# EAGLE design measurementdevice (EAGLE 9.3.0)

## Sheet 1 of 3: Connectors
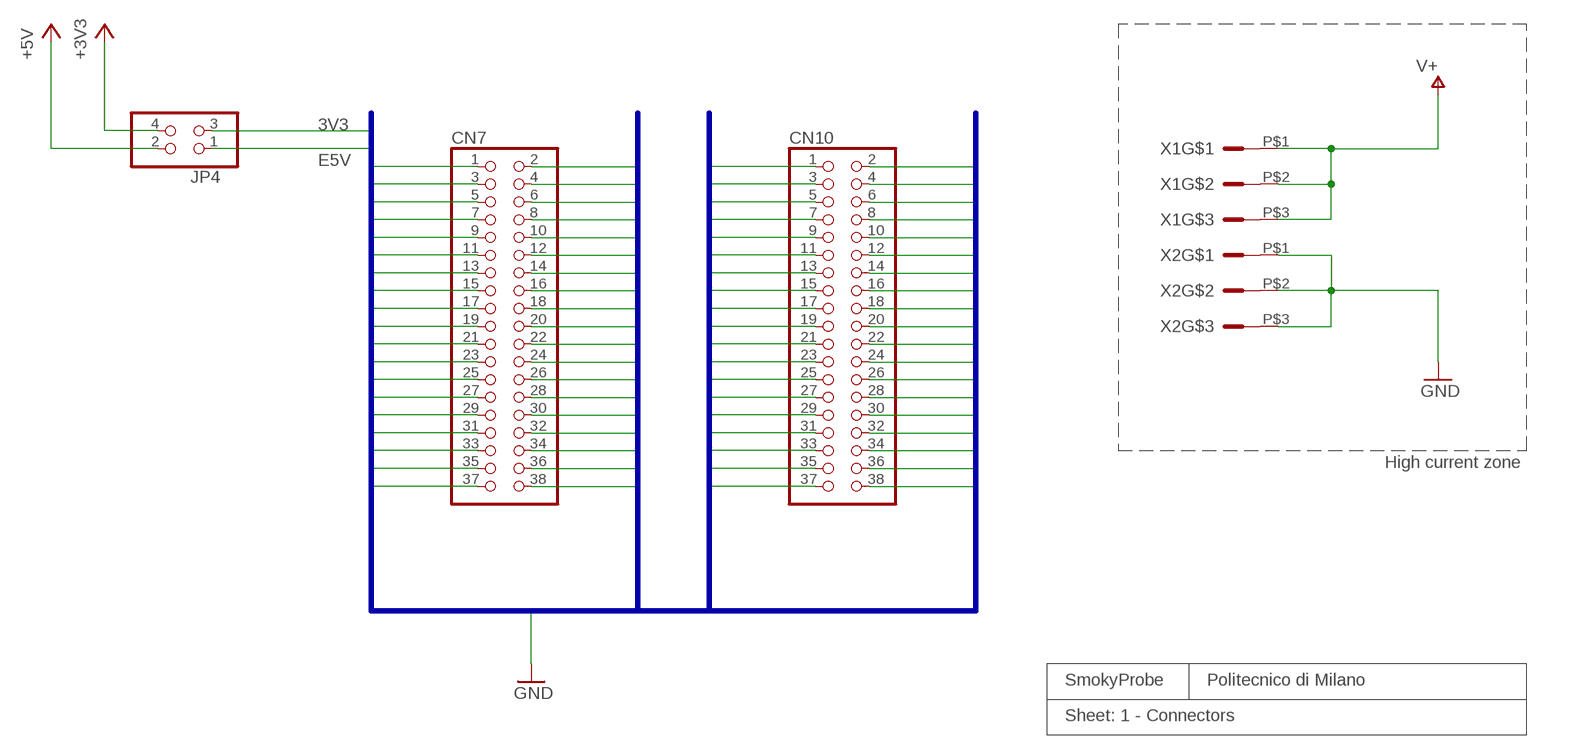
[diagram p0: schematic, sheet 1]

### Parts
CN7  PINHD-2X19  [2X19]
CN10  PINHD-2X19  [2X19]
JP4  PINHD-2X2  [2X02]
X1  PT1.5/3-50H-3  [PT1.5/3-50H-3]
X2  PT1.5/3-50H-3  [PT1.5/3-50H-3]

### Nets
3V3: CN7.16 JP4.3
5V: CN7.18
5V-USB-CHG: CN10.8
+3V3: JP4.4 ; also sheet 3
+5V: JP4.2 ; also sheet 2
AGND: CN10.32
AVDD: CN10.7
E5V: CN7.6 JP4.1
GND: CN7.8 CN7.19 CN7.20 CN7.22 CN10.9 CN10.20 X2.P$1 X2.P$2 X2.P$3 ; also sheet 2,3
IOREF: CN7.12
NRST: CN7.14
PA0: CN7.28
PA1: CN7.30
PA2: CN10.34
PA3: CN10.6
PA4: CN7.32
PA5: CN10.11
PA6: CN10.13
PA7: CN10.15
PA8: CN10.23
PA9: CN10.21
PA10: CN10.33
PA11: CN10.14
PA12: CN10.12
PA13: CN7.13
PA14: CN7.7
PA15: CN7.17
PB0: CN10.17
PB1: CN7.34
PB2: CN10.22
PB3: CN10.31
PB4: CN10.27
PB5: CN10.29
PB6: CN10.24
PB7: CN7.21
PB8: CN10.3 ; also sheet 3
PB9: CN10.5 ; also sheet 3
PB10: CN10.28 ; also sheet 3
PB11: CN7.36 ; also sheet 3
PB12: CN7.38
PB13: CN10.30
PB14: CN10.25
PB15: CN10.26
PC0: CN10.18
PC1: CN10.16
PC2: CN7.35
PC3: CN7.37
PC4: CN10.35
PC5: CN10.37
PC6: CN10.4
PC7: CN10.19
PC8: CN10.2
PC9: CN10.1
PC10: CN7.1
PC11: CN7.2
PC12: CN7.3
PC13: CN7.23
PC14: CN7.25
PC15: CN7.27
PD0: CN7.9
PD1: CN7.10
PD2: CN7.4
PD3: CN7.11
PD4: CN7.15
PD5: CN7.26
PD6: CN10.10
PD8: CN10.36
PD9: CN10.38
PF0: CN7.29
PF1: CN7.31
V+: X1.P$1 X1.P$2 X1.P$3 ; also sheet 2,3
VBAT: CN7.33
VDD: CN7.5
VIN: CN7.24

### Buses
NUCLEO64:3V3,5V,5V-USB-CHG,AGND,AVDD,E5V,GND,IOREF,NRST,PA[0..15],PB[0..15],PC[0..15],PD[0..9],PF0,PF1,VBAT,VDD,VIN

### Notes on the sheet
- High current zone
- SmokyProbe | Politecnico di Milano
- Sheet: 1 - Connectors

## Sheet 2 of 3: Power Supply
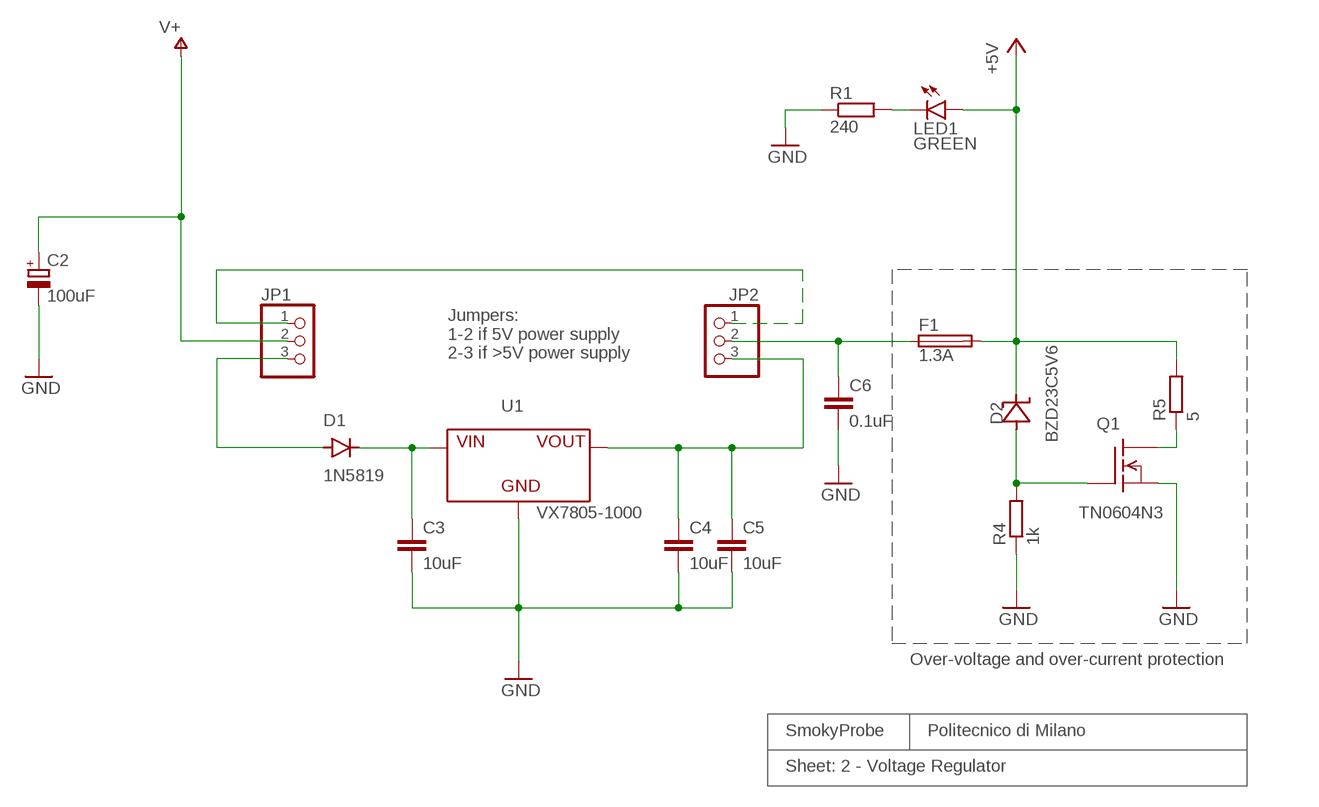
[diagram p1: schematic, sheet 2]

### Parts
C2  100uF  CPOL-EUE3.5-8  [E3,5-8]
C3  10uF  C-EUC1206  [C1206]
C4  10uF  C-EUC1206  [C1206]
C5  10uF  C-EUC1206  [C1206]
C6  0.1uF  C-EUC0603  [C0603]
D1  1N5819  1N4933  [DO41-10]
D2  BZD23C5V6  1N5339BG  [SOD81-ED]
F1  1.3A  LITTLEFUSE  [LITTLEFUSE]
JP1  PINHD-1X3  [1X03]
JP2  PINHD-1X3  [1X03]
LED1  GREEN  LEDCHIP-LED0805  [CHIP-LED0805]
Q1  TN0604N3  [TO-92]
R1  240  R-EU_R0805  [R0805]
R4  1k  R-EU_R0805  [R0805]
R5  5  R-EU_R1206  [R1206]
U1  VX7805-1000  [VX78-1000]

### Nets
+5V: D2.C F1.2 LED1.A R5.2 ; also sheet 1
GND: C2.- C3.2 C4.2 C5.2 C6.2 Q1.1(S) R1.1 R4.1 U1.P$2(GND) ; also sheet 1,3
N$1: C3.1 D1.C U1.P$1(VIN)
N$2: D1.A JP1.3
N$3: LED1.C R1.2
N$4: JP1.1 JP2.1
N$5: D2.A Q1.2(G) R4.2
N$6: C4.1 C5.1 JP2.3 U1.P$3(VOUT)
N$8: Q1.3(D) R5.1
N$9: C6.1 F1.1 JP2.2
V+: C2.+ JP1.2 ; also sheet 1,3

### Notes on the sheet
- Jumpers:
  1-2 if 5V power supply
  2-3 if >5V power supply
- Over-voltage and over-current protection
- SmokyProbe | Politecnico di Milano
- Sheet: 2 - Voltage Regulator

## Sheet 3 of 3: Main
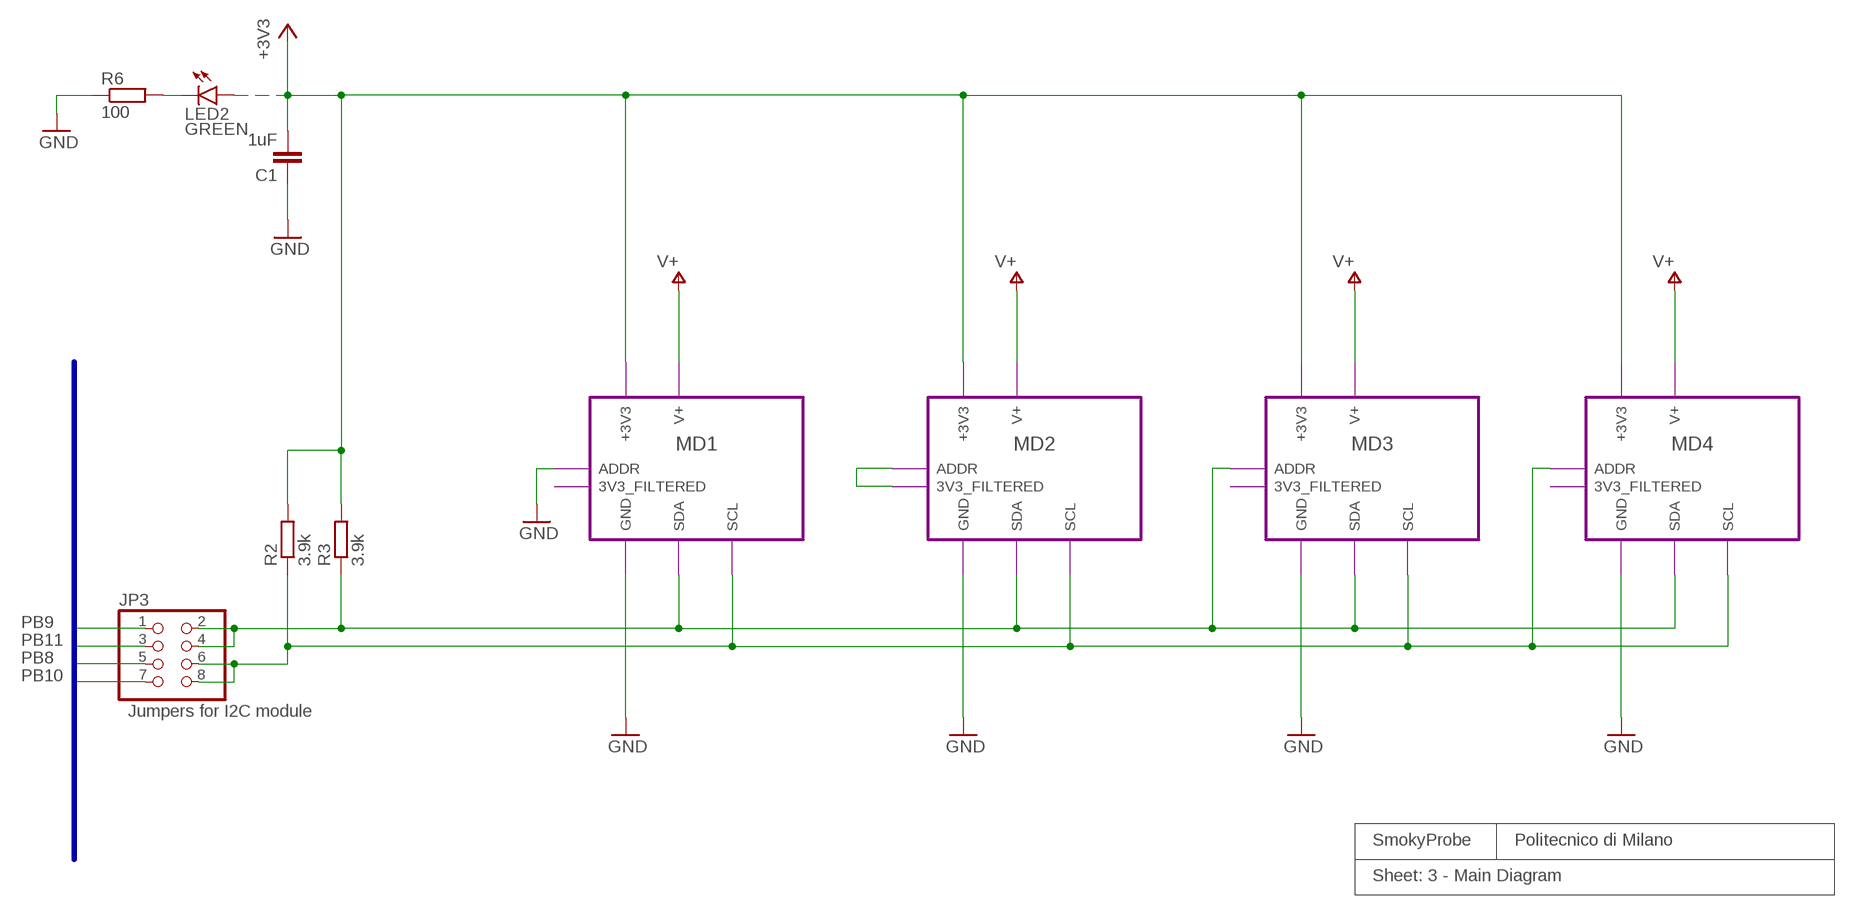
[diagram p2: schematic, sheet 3]

### Parts
C1  1uF  C-EUC0603  [C0603]
JP3  PINHD-2X4  [2X04]
LED2  GREEN  LEDCHIP-LED0805  [CHIP-LED0805]
R2  3.9k  R-EU_R0603  [R0603]
R3  3.9k  R-EU_R0603  [R0603]
R6  100  R-EU_R0805  [R0805]

### Module instances
MD1 = MD
MD2 = MD
MD3 = MD
MD4 = MD

### Nets
+3V3: C1.2 LED2.A R2.2 R3.2 ; port MD2.+3V3 MD1.+3V3 MD3.+3V3 MD4.+3V3 ; also sheet 1
GND: C1.1 R6.1 ; port MD1.GND MD2.GND MD3.GND MD4.GND MD1.ADDR ; also sheet 1,2
N$7: LED2.C R6.2
N$10: port MD2.ADDR MD2.3V3_FILTERED
PB8: JP3.5 ; also sheet 1
PB9: JP3.1 ; also sheet 1
PB10: JP3.7 ; also sheet 1
PB11: JP3.3 ; also sheet 1
SCL: JP3.6 JP3.8 R2.1 ; port MD1.SCL MD2.SCL MD3.SCL MD4.SCL MD4.ADDR
SDA: JP3.2 JP3.4 R3.1 ; port MD1.SDA MD2.SDA MD3.SDA MD4.SDA MD3.ADDR
V+: port MD3.V+ MD4.V+ MD2.V+ MD1.V+ ; also sheet 1,2

### Buses
NUCLEO64:3V3,5V,5V-USB-CHG,AGND,AVDD,E5V,GND,IOREF,NRST,PA[0..15],PB[0..15],PC[0..15],PD[0..9],PF0,PF1,VBAT,VDD,VIN

### Notes on the sheet
- Jumpers for I2C module
- SmokyProbe | Politecnico di Milano
- Sheet: 3 - Main Diagram

## Library data of the parts
C1 C3-C6 = rcl:C-EU: CAPACITOR, European symbol; SPICEPREFIX: C
C2 = rcl:CPOL-EU: POLARIZED CAPACITOR, European symbol; SPICEPREFIX: C
CN7 CN10 = pinhead:PINHD-2X19: PIN HEADER
D1 = diode:1N4933: DIODE fast recovery rectifier, 1A
D2 = PersonalLibrary:1N5339BG
F1 = PersonalLibrary:LITTLEFUSE; SPICEPREFIX: F
JP1 JP2 = pinhead:PINHD-1X3: PIN HEADER
JP3 = pinhead:PINHD-2X4: PIN HEADER
JP4 = pinhead:PINHD-2X2: PIN HEADER
LED1 LED2 = led:LED: LED OSRAM: - CHIPLED LG R971, LG N971, LY N971, LG Q971, LY Q971, LO R971, LY R971 LH N974, LH R974 LS Q976, LO Q976, LY Q976 LO Q996 - Hyper CHIPLED LW Q18S LB Q993, LB Q99A, LB R99A - SideLED LS A670, LO A670, LY A670, LG A670, LP A670 LB A673, LV A673, LT A673, LW A673 LH A674 LY A675 LS A676, LA A676, LO A676, LY A676, LW A676 LS A679, LY A679, LG A679 - Hyper Micro SIDELED® LS Y876, LA Y876, LO Y876, LY Y876 LT Y87S - SmartLED LW L88C, LW L88S LB L89C, LB L89S, LG L890 LS L89K, LO L89K, LY L89K LS L896, LA L896, LO L896, LY L896 - TOPLED LS T670, LO T670, LY T670, LG T670, LP T670 LSG T670, LSP T670, LSY T670, LOP T670, LYG T670 LG T671, LOG T671, LSG T671 LB T673, LV T673, LT T673, LW T673 LH T674 LS T676, LA T676, LO T676, LY T676, LB T676, LH T676, LSB T676, LW T676 LB T67C, LV T67C, LT T67C, LS T67K, LO T67K, LY T67K, LW E67C LS E67B, LA E67B, LO E67B, LY E67B, LB E67C, LV E67C, LT E67C LW T67C LS T679, LY T679, LG T679 LS T770, LO T770, LY T770, LG T770, LP T770 LB T773, LV T773, LT T773, LW T773 LH T774 LS E675, LA E675, LY E675, LS T675 LS T776, LA T776, LO T776, LY T776, LB T776 LHGB T686 LT T68C, LB T68C - Hyper Mini TOPLED® LB M676 - Mini TOPLED Santana® LG M470 LS M47K, LO M47K, LY M47K Source: http://www.osram.convergy.de LUXEON: - LUMILED® LXK2-PW12-R00, LXK2-PW12-S00, LXK2-PW14-U00, LXK2-PW14-V00 LXK2-PM12-R00, LXK2-PM12-S00, LXK2-PM14-U00 LXK2-PE12-Q00, LXK2-PE12-R00, LXK2-PE12-S00, LXK2-PE14-T00, LXK2-PE14-U00 LXK2-PB12-K00, LXK2-PB12-L00, LXK2-PB12-M00, LXK2-PB14-N00, LXK2-PB14-P00, LXK2-PB14-Q00 LXK2-PR12-L00, LXK2-PR12-M00, LXK2-PR14-Q00, LXK2-PR14-R00 LXK2-PD12-Q00, LXK2-PD12-R00, LXK2-PD12-S00 LXK2-PH12-R00, LXK2-PH12-S00 LXK2-PL12-P00, LXK2-PL12-Q00, LXK2-PL12-R00 Source: www.luxeon.com KINGBRIGHT: KA-3528ASYC Source: www.kingbright.com
Q1 = transistor-fet:TN0604N3: N-Channel Enhancement MOSFET 40V; 4A; 0,75Ohm
R1 R4-R6 = rcl:R-EU_: RESISTOR, European symbol; SPICEPREFIX: R
R2 R3 = resistor:R-EU_: RESISTOR, European symbol
U1 = PersonalLibrary:VX7805-1000
X1 X2 = PersonalLibrary:PT1.5/3-50H-3

## Module MD
Ports: ADDR(io) SDA(io) SCL(io) +3V3(io) V+(io) GND(io) 3V3_FILTERED(io)
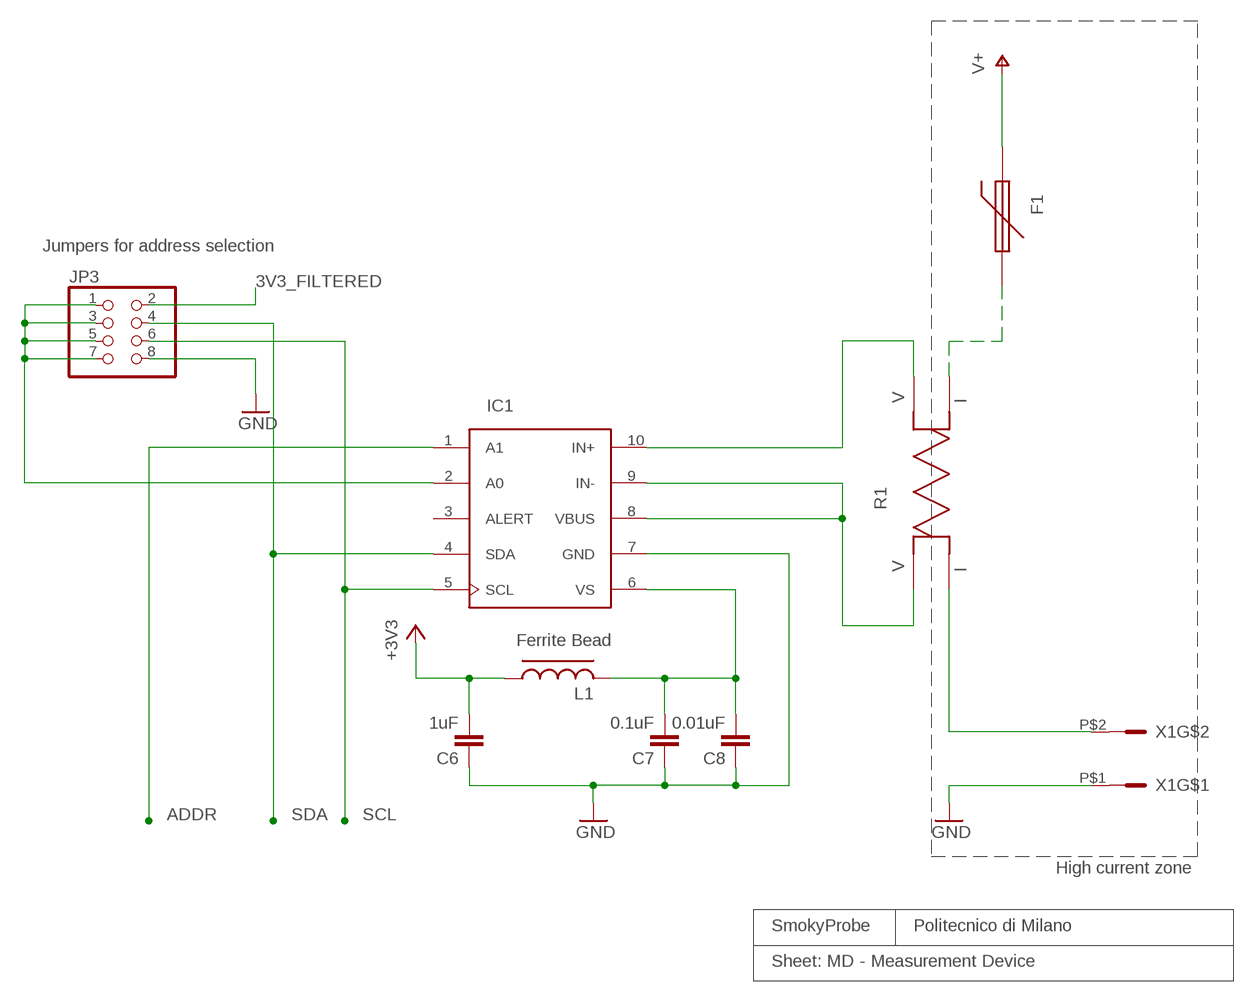
[diagram p3: schematic, module MD, sheet 1]

### Parts
C6  1uF  C-EUC0603  [C0603]
C7  0.1uF  C-EUC0603  [C0603]
C8  0.01uF  C-EUC0603  [C0603]
F1  RUEF900RUEF900  [RUEF900]
IC1  INA233  [VSSOP10]
JP3  PINHD-2X4  [2X04]
L1  Ferrite Bead  FERRITE0603  [0603]
R1  LVK25  [1224]
X1  PT1.5/3-50H-2  [PT1.5/3-50H-2]

### Nets
3V3_FILTERED: C7.2 C8.2 IC1.6(VS) JP3.2 L1.N2
+3V3: C6.2 L1.N1
A0: IC1.2(A0) JP3.1 JP3.3 JP3.5 JP3.7
ADDR: IC1.1(A1)
GND: C6.1 C7.1 C8.1 IC1.7(GND) JP3.8 X1.P$1
PWR_IN: F1.P$2 R1.2(I2)
PWR_OUT: R1.1(I1) X1.P$2
SCL: IC1.5(SCL) JP3.6
SDA: IC1.4(SDA) JP3.4
SENSE1: IC1.10(IN+) R1.3(V2)
SENSE2: IC1.8(VBUS) IC1.9(IN-) R1.4(V1)
V+: F1.P$1
Unconnected: IC1.3(ALERT)

### Notes on the sheet
- Jumpers for address selection
- High current zone
- SmokyProbe | Politecnico di Milano
- Sheet: MD - Measurement Device

### Library data of the parts
C6-C8 = rcl:C-EU: CAPACITOR, European symbol; SPICEPREFIX: C
F1 = PersonalLibrary:RUEF900
IC1 = PersonalLibrary:INA233
JP3 = pinhead:PINHD-2X4: PIN HEADER
L1 = PersonalLibrary:FERRITE0603
R1 = PersonalLibrary:LVK25
X1 = PersonalLibrary:PT1.5/3-50H-2

## Net classes
0 default: clearance 0.152 mm

## Board
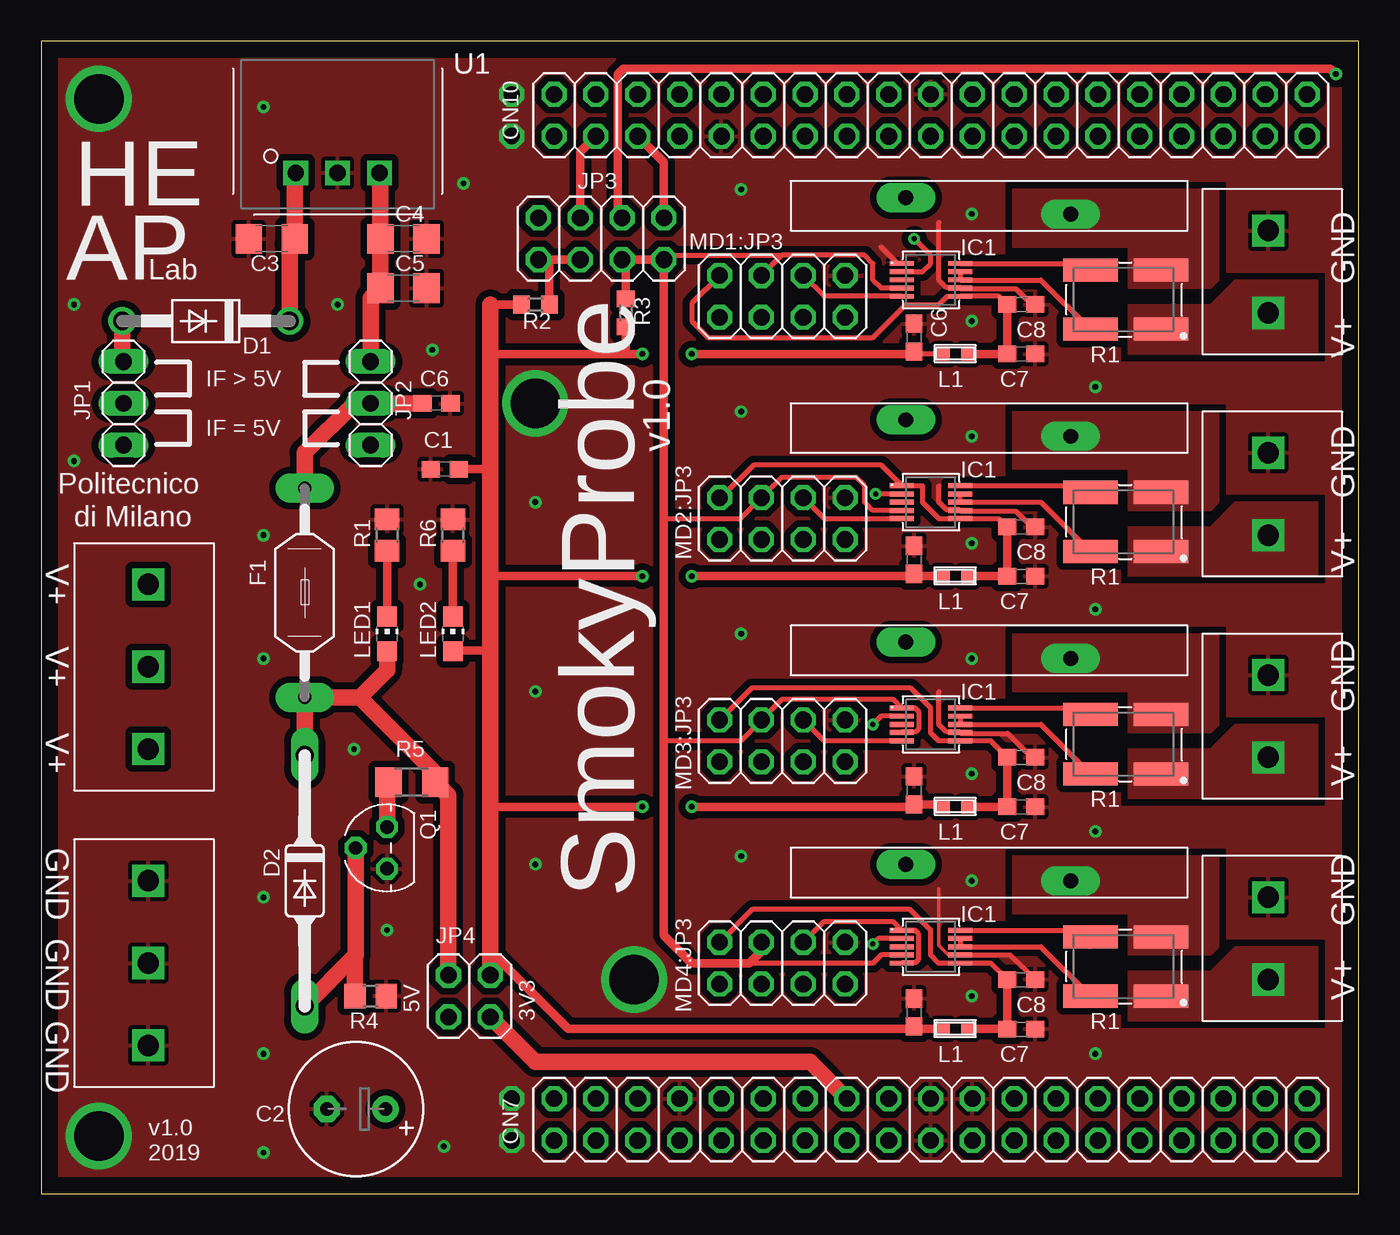
[diagram p4: board, top side]
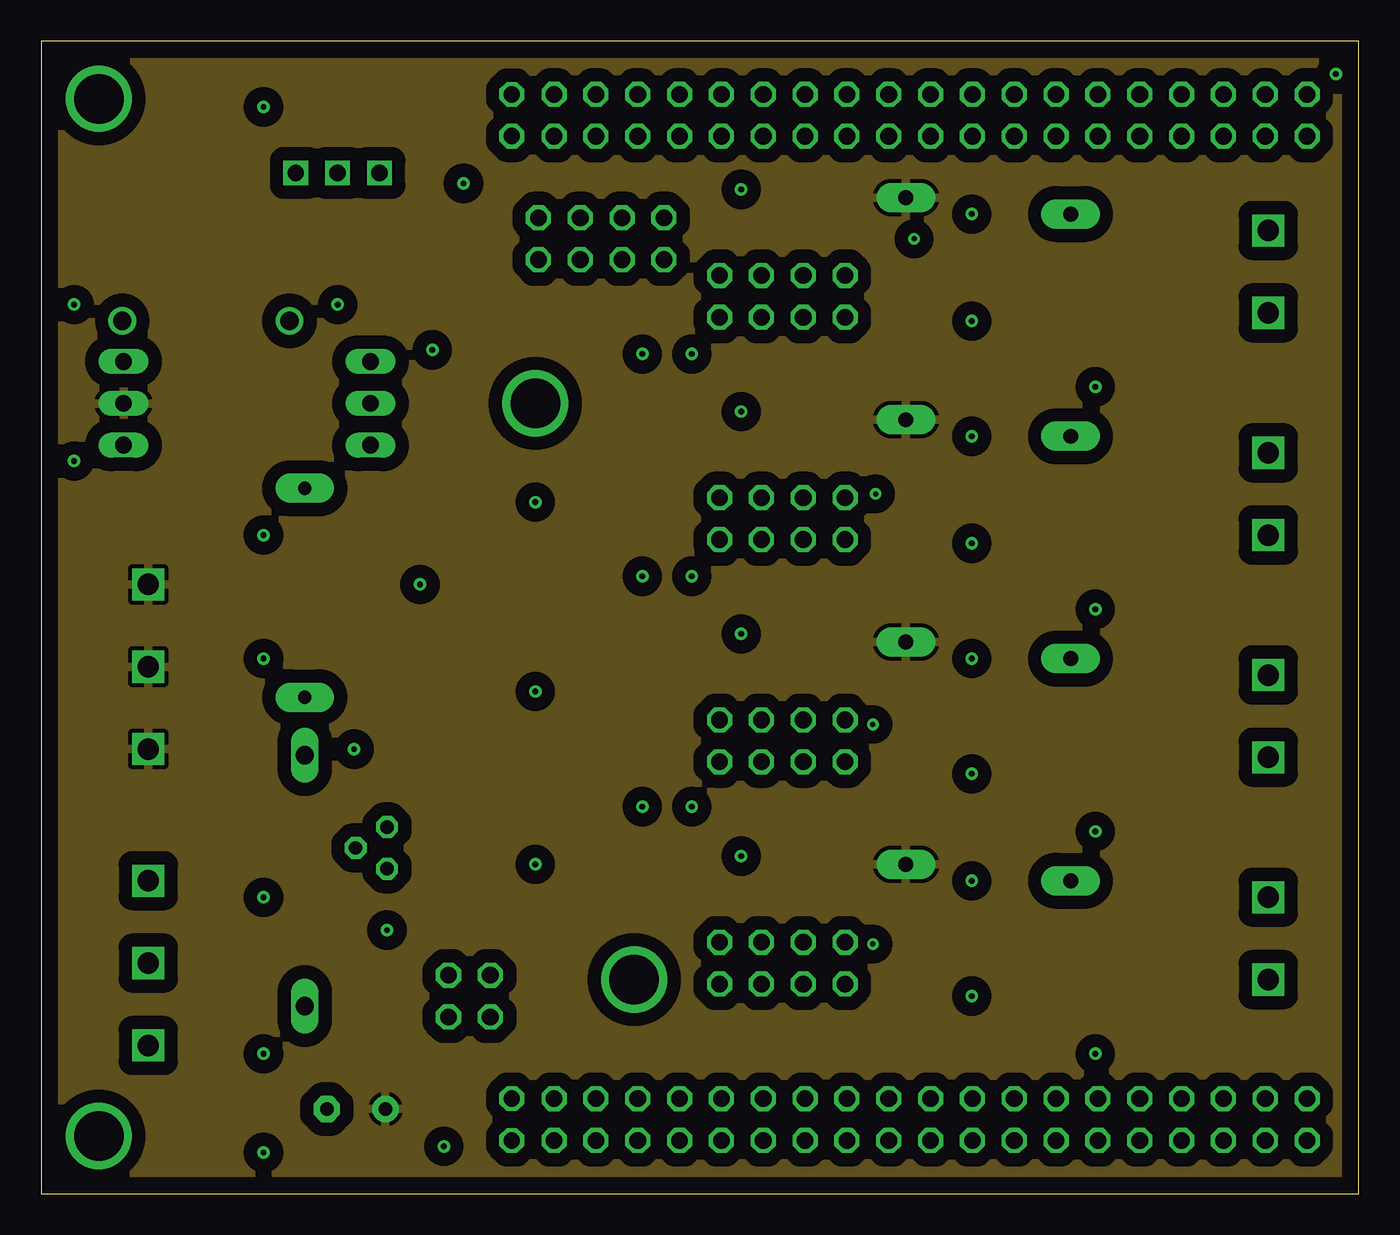
[diagram p5: board, inner layer Power]
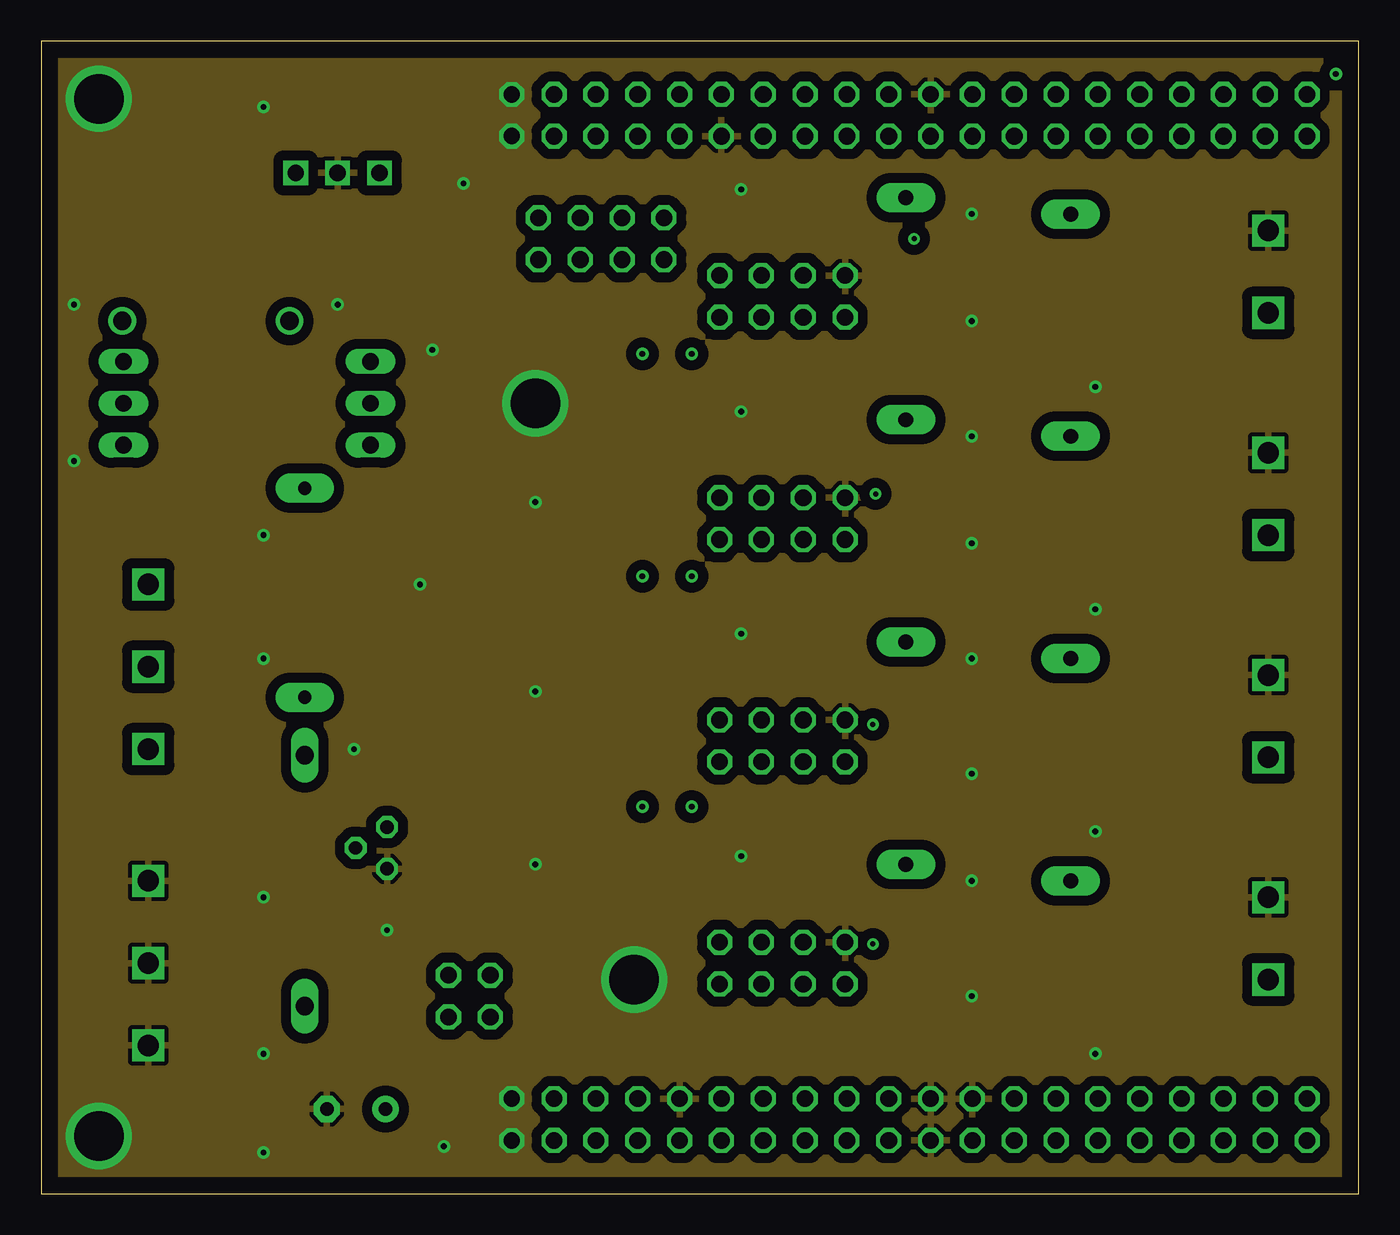
[diagram p6: board, inner layer Ground]
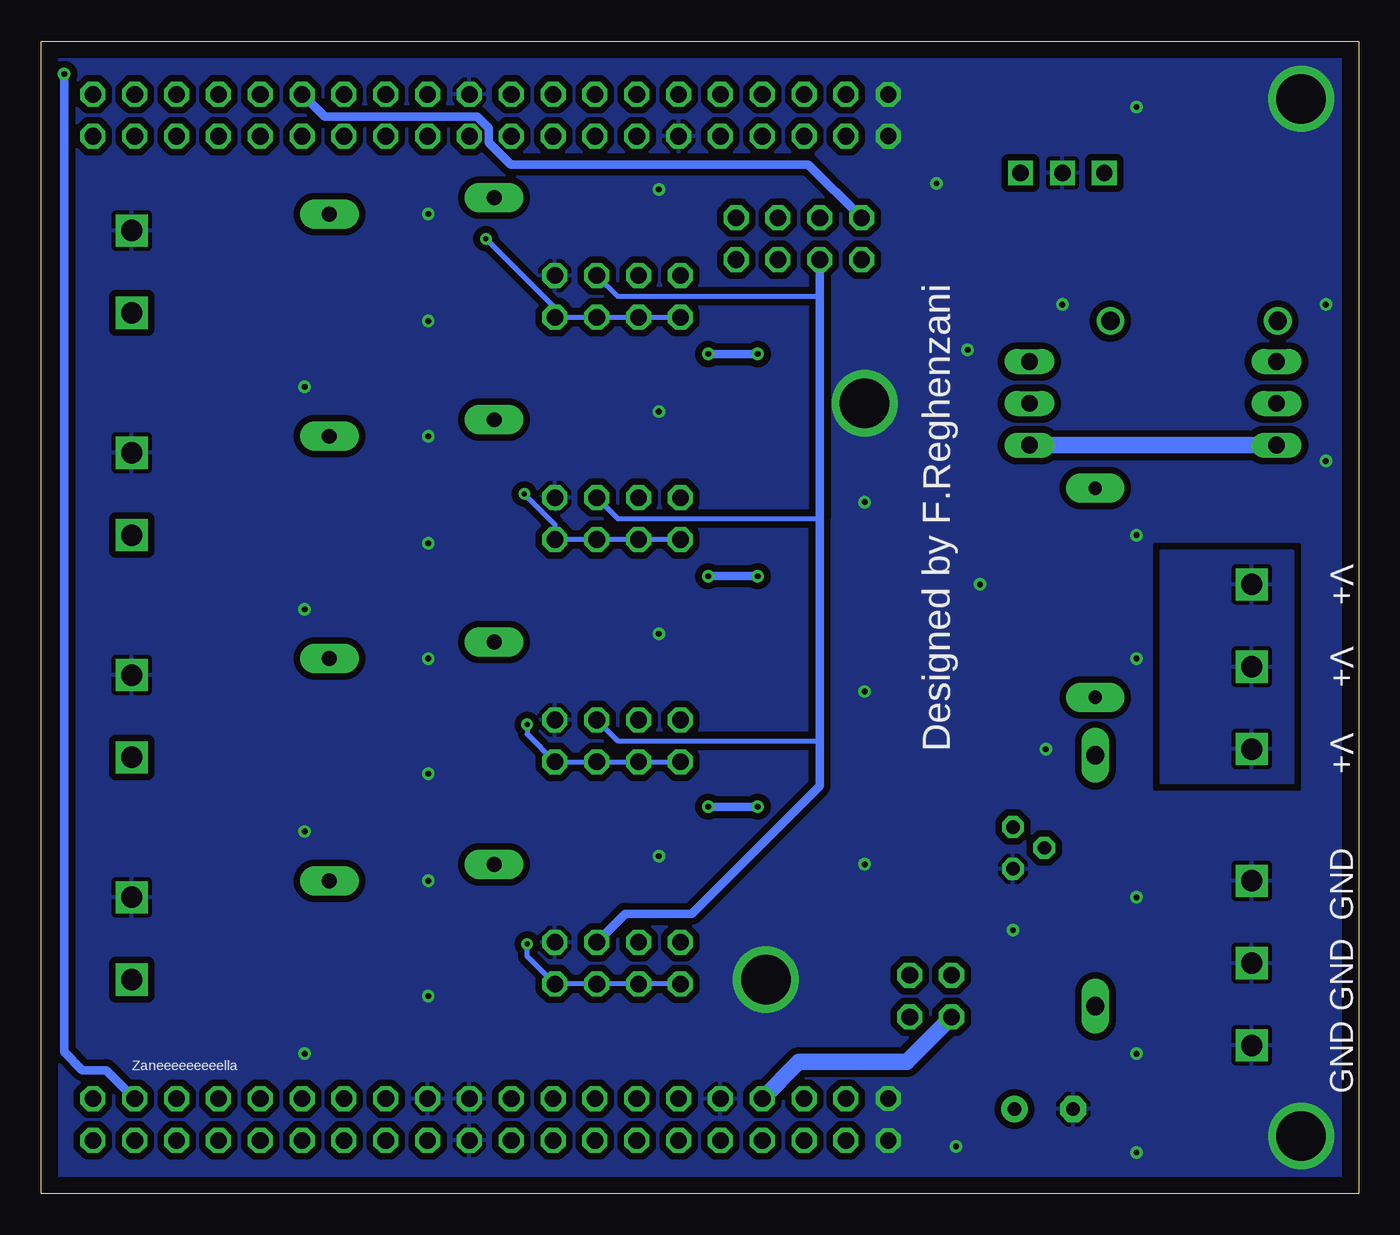
[diagram p7: board, bottom side, seen from below]

Size 80 x 70 mm. Coordinates in mm from the lower left corner, seen from the top.
Outline: 0,0 80,0 80,70 0,70 0,0
Copper layers (1+2*15+16): Top 0.035mm / dielectric 1.6mm / Power 0.035mm / dielectric 0.15mm / Ground 0.035mm / dielectric 0.2mm / Bottom 0.035mm
Design rules "default *": minimum track width 6mil, minimum drill 0.3mm, track to track 6mil, track to pad 6mil, pad to pad 6mil, via to via 6mil, smd to smd 6mil, copper to edge 40mil, drill to drill 6mil, minimum pad ring 10mil, minimum via ring 8mil, stop-mask expansion 4mil, vias tented up to drill 0mil, thermal gap 10mil

### Footprints (pad centres in the part's own frame; a part is rotated, then mirrored left to right if it is on the bottom)
C0603 = smd 1.1 x 1: 1 -0.85,0; 2 0.85,0
E3,5-8 = drill 0.813 pad 1.6: + -1.778,0 | drill 0.813 pad 1.6 octagon: - 1.778,0
C1206 = smd 1.6 x 1.8: 1 -1.4,0; 2 1.4,0
2X19 = drill 1.016 octagon: 1 -22.86,-1.27; 2 -22.86,1.27; 3 -20.32,-1.27; 4 -20.32,1.27; 5 -17.78,-1.27; 6 -17.78,1.27; 7 -15.24,-1.27; 8 -15.24,1.27; 9 -12.7,-1.27; 10 -12.7,1.27; 11 -10.16,-1.27; 12 -10.16,1.27; 13 -7.62,-1.27; 14 -7.62,1.27; 15 -5.08,-1.27; 16 -5.08,1.27; 17 -2.54,-1.27; 18 -2.54,1.27; 19 0,-1.27; 20 0,1.27; 21 2.54,-1.27; 22 2.54,1.27; 23 5.08,-1.27; 24 5.08,1.27; 25 7.62,-1.27; 26 7.62,1.27; 27 10.16,-1.27; 28 10.16,1.27; 29 12.7,-1.27; 30 12.7,1.27; 31 15.24,-1.27; 32 15.24,1.27; 33 17.78,-1.27; 34 17.78,1.27; 35 20.32,-1.27; 36 20.32,1.27; 37 22.86,-1.27; 38 22.86,1.27
DO41-10 = drill 1.118: A 5.08,0; C -5.08,0
SOD81-ED = drill 1.118 long: A 7.62,0; C -7.62,0
LITTLEFUSE = drill 0.813 pad 1.778 long: 1 -6.35,0; 2 6.35,0
1X03 = drill 1.016 long: 1 -2.54,0; 2 0,0; 3 2.54,0
2X04 = drill 1.016 octagon: 1 -3.81,-1.27; 2 -3.81,1.27; 3 -1.27,-1.27; 4 -1.27,1.27; 5 1.27,-1.27; 6 1.27,1.27; 7 3.81,-1.27; 8 3.81,1.27
2X02 = drill 1.016 octagon: 1 -1.27,-1.27; 2 -1.27,1.27; 3 1.27,-1.27; 4 1.27,1.27
CHIP-LED0805 = smd 1.2 x 1.2: A 0,-1.05; C 0,1.05
RUEF900 = drill 0.9 pad 1.778 long: P$1 7,2; P$2 17,1
VSSOP10 = smd 0.3 x 1.45: 1 0.5,0.75; 2 1,0.75; 3 1.5,0.75; 4 2,0.75; 5 2.5,0.75; 6 2.5,4.3; 7 2,4.3; 8 1.5,4.3; 9 1,4.3; 10 0.5,4.3
0603 = smd 0.8 x 0.8: N1 -0.75,0; N2 0.75,0
1224 = smd 1.4 x 3.3: 1 0,0; 2 3.6,0; 3 3.6,4.3; 4 0,4.3
PT1.5/3-50H-2 = drill 1.3 square: P$1 2.5,4; P$2 7.5,4
TO-92 = drill 0.813 octagon: 1 -1.27,0; 2 0,1.905; 3 1.27,0
R0805 = smd 1.3 x 1.5: 1 -0.95,0; 2 0.95,0
R0603 = smd 1 x 1.1: 1 -0.85,0; 2 0.85,0
R1206 = smd 1.6 x 1.803: 1 -1.422,0; 2 1.422,0
VX78-1000 = drill 0.991 square: P$1 -2.54,0; P$2 0,0; P$3 2.54,0
PT1.5/3-50H-3 = drill 1.3 square: P$1 2.5,4; P$2 7.5,4; P$3 12.5,4

### Placement (x,y rotation side)
C1  24.5,44 0 top
C2  19.12,5.14 180 top
C3  14,58 180 top
C4  22,58 0 top
C5  22,55 0 top
C6  24,48 0 top
CN7  54,4.5 0 top
CN10  54,65.5 0 top
D1  10,53 180 top
D2  16,19 270 top
F1  16,36.5 270 top
JP1  5,48 90 top
JP2  20,48 90 top
JP3  34,58 180 top
JP4  26,12 0 top
LED1  21,34 0 top
LED2  25,34 0 top
MD1:C6  1uF  [C0603]  53,52 270 top
MD1:C7  0.1uF  [C0603]  59.5,51 180 top
MD1:C8  0.01uF  [C0603]  59.5,54 180 top
MD1:F1  [RUEF900]  45.5,58.5 0 top
MD1:IC1  [VSSOP10]  51.5,57 270 top
MD1:JP3  [2X04]  45,54.5 0 top
MD1:L1  Ferrite Bead  [0603]  55.5,51 0 top
MD1:R1  [1224]  68,52.5 90 top
MD1:X1  PT1.5/3-50H-2  [PT1.5/3-50H-2]  70.5,61 270 top
MD2:C6  1uF  [C0603]  53,38.5 270 top
MD2:C7  0.1uF  [C0603]  59.5,37.5 180 top
MD2:C8  0.01uF  [C0603]  59.5,40.5 180 top
MD2:F1  [RUEF900]  45.5,45 0 top
MD2:IC1  [VSSOP10]  51.5,43.5 270 top
MD2:JP3  [2X04]  45,41 0 top
MD2:L1  Ferrite Bead  [0603]  55.5,37.5 0 top
MD2:R1  [1224]  68,39 90 top
MD2:X1  PT1.5/3-50H-2  [PT1.5/3-50H-2]  70.5,47.5 270 top
MD3:C6  1uF  [C0603]  53,24.5 270 top
MD3:C7  0.1uF  [C0603]  59.5,23.5 180 top
MD3:C8  0.01uF  [C0603]  59.5,26.5 180 top
MD3:F1  [RUEF900]  45.5,31.5 0 top
MD3:IC1  [VSSOP10]  51.5,30 270 top
MD3:JP3  [2X04]  45,27.5 0 top
MD3:L1  Ferrite Bead  [0603]  55.5,23.5 0 top
MD3:R1  [1224]  68,25.5 90 top
MD3:X1  PT1.5/3-50H-2  [PT1.5/3-50H-2]  70.5,34 270 top
MD4:C6  1uF  [C0603]  53,11 270 top
MD4:C7  0.1uF  [C0603]  59.5,10 180 top
MD4:C8  0.01uF  [C0603]  59.5,13 180 top
MD4:F1  [RUEF900]  45.5,18 0 top
MD4:IC1  [VSSOP10]  51.5,16.5 270 top
MD4:JP3  [2X04]  45,14 0 top
MD4:L1  Ferrite Bead  [0603]  55.5,10 0 top
MD4:R1  [1224]  68,12 90 top
MD4:X1  PT1.5/3-50H-2  [PT1.5/3-50H-2]  70.5,20.5 270 top
Q1  21,21 90 top
R1  21,40 270 top
R2  30,54 180 top
R3  35.5,53.5 270 top
R4  20,12 180 top
R5  22.5,25 0 top
R6  25,40 270 top
U1  18,62 0 top
X1  10.5,24.5 90 top
X2  10.5,6.5 90 top

### Tracks (layer width: path | path; a pad name or v marks a point on that pad's centre or on a via)
3V3
  Top 1.016: JP4.3 30,8 46.69,8 CN7.16
+3V3  (via drill 0.35)
  Top 0.305: MD1:L1.N1 52.85,51
  Top 0.508: LED2.A 25.05,33 27.27,33 | R2.2 27.27,54 | v36.5,37.5 27.27,37.5 | v36.5,23.5 27.27,23.5 | C1.2 27.27,44 | 27.27,51 35.5,51 | v36.5,51 35.5,51 | R3.2 35.5,51 | MD1:C6.2 52.85,51 v39.5,51 | MD2:L1.N1 53.15,37.5 | 53.15,37.5 MD2:C6.2 | v39.5,37.5 53.15,37.5 | v39.5,23.5 52.85,23.5 MD3:C6.2 54.6,23.65 MD3:L1.N1 | MD4:L1.N1 53.15,10 MD4:C6.2 52.85,10 32,10 27.5,14.5 27.27,14.5
  Top 1.016: JP4.4 27.27,14.5 27.27,23.5 27.27,33 27.27,37.5 27.27,44 27.27,51 27.27,54
  Bottom 0.508: v39.5,37.5 v36.5,37.5 | v39.5,23.5 v36.5,23.5 | v39.5,51 v36.5,51
+5V
  Top 1.016: JP4.2 24.73,24.19 R5.2 23.92,25.42 24,25.5 19.35,30.15 | D2.C F1.2 19.35,30.15 | LED1.A 21,31.8 19.35,30.15
E5V
  Bottom 1.016: CN7.6 33.99,8 27.46,8 JP4.1
GND  (via drill 0.35, 1, 3)
  Top 0.203: 54.5,18.5 54.5,15.07 55.07,14.5 MD4:IC1.7
  Top 0.305: 54.5,43 54.5,42 54.77,41.73 54.77,41.72 54.95,41.54 55.76,41.54 MD2:IC1.7 55.84,41.46 59.17,41.46 60.13,40.5 MD2:C8.1 | MD3:C8.1 60.13,26.5 58.67,27.96 55.84,27.96 MD3:IC1.7 55.76,28.04 54.95,28.04 54.5,28.49 54.5,30.5 | MD1:IC1.1 52,56.5 51,57.5 | MD1:C8.1 60.13,54 59.17,54.96 55.84,54.96 MD1:IC1.7 55.76,55.04 54.95,55.04 54.5,55.49 54.5,59 | MD4:IC1.7 58.85,14.5 MD4:C8.1
  other vias: 3.5,66.5 30,48 36,13 3.5,3.5 25.64,61.36 2,44.5 2,54 18,54 23.75,51.25 13.5,40 13.5,32.5 13.5,18 13.5,2.5 24.45,2.87 21,16 19,27 23,37 30,42 30,30.5 30,20 13.5,66 13.5,8.5 28.57,5.77 28.57,3.23 28.57,66.77 28.57,64.23 56.5,19 56.5,32.5 56.5,46 56.5,59.5 42.5,47.5 42.5,34 42.5,20.5 42.5,61 64,49 64,35.5 64,22 64,8.5 56.5,39.5 56.5,25.5 56.5,12 56.5,53
  pour Ground (isolate 0.61): -7,77 -7,-6 -3,-6 88,-6 88,-2 88,77
  pour Bottom: 4,21 12,21 12,7 4,7
  pour Top (isolate 0.406, rank 2): -10,78 -10,-9 92,-9 92,81 -10,81
  pour Bottom (isolate 0.406, rank 2): -13,84 -13,-12 95,-12 95,84 92,84
MD1:3V3_FILTERED
  Top 0.305: MD1:C8.2 58.15,54.5 MD1:IC1.6 55,54.5 54.5,54 52.5,54 50.5,52 40.5,52 39.5,53 39.5,54.08 MD1:JP3.2
  Top 0.508: MD1:L1.N2 MD1:C7.2 MD1:C8.2
MD1:A0  (via drill 0.3)
  Top 0.305: MD1:IC1.2 53.5,56 54,56.5 54,57 v53,58
  Bottom 0.305: MD1:JP3.1 MD1:JP3.3 MD1:JP3.5 MD1:JP3.7 48.81,53.81 v53,58
MD1:PWR_IN
  pour Top (isolate 0.406, no thermals): 66,55 66,57.5 59,57.5 59,61 71.5,61 71.5,55.5 71,55
MD1:PWR_OUT
  pour Top (isolate 0.406, no thermals): 77.5,55.5 72.5,55.5 71,54 66,54 66,51 77.5,51
MD1:SENSE1
  Top 0.305: MD1:IC1.10 63.3,56.5 MD1:R1.3
MD1:SENSE2
  Top 0.305: MD1:IC1.9 MD1:IC1.8 60.7,55.5 MD1:R1.4
MD2:A0  (via drill 0.3)
  Top 0.305: MD2:IC1.2 v50.66,42.5
  Bottom 0.305: MD2:JP3.1 MD2:JP3.3 MD2:JP3.5 MD2:JP3.7 48.81,40.65 v50.66,42.5
MD2:PWR_IN
  pour Top (isolate 0.406, no thermals): 66,41.5 66,44 59,44 59,47.5 71.5,47.5 71.5,42 71,41.5
MD2:PWR_OUT
  pour Top (isolate 0.406, no thermals): 77.5,42 72.5,42 71,40.5 66,40.5 66,37.5 77.5,37.5
MD2:SENSE1
  Top 0.305: MD2:R1.3 63.3,43 MD2:IC1.10
MD2:SENSE2
  Top 0.305: MD2:IC1.9 MD2:IC1.8 60.7,42 MD2:R1.4
MD3:3V3_FILTERED
  Top 0.305: MD3:C8.2 57.65,27.5 MD3:IC1.6 54.49,27.5 54,27.99 54,29.5 52.79,30.71 43.13,30.71 MD3:JP3.2
  Top 0.508: MD3:L1.N2 MD3:C7.2 MD3:C8.2
MD3:A0  (via drill 0.3)
  Top 0.305: MD3:IC1.2 51,29 v50.5,28.5
  Bottom 0.305: v50.5,28.5 50.5,27.92 MD3:JP3.7 MD3:JP3.5 MD3:JP3.3 MD3:JP3.1
MD3:PWR_IN
  pour Top (isolate 0.406, no thermals): 66,28 66,30.5 59,30.5 59,34 71.5,34 71.5,28.5 71,28
MD3:PWR_OUT
  pour Top (isolate 0.406, no thermals): 77.5,28.5 72.5,28.5 71,27 66,27 66,24 77.5,24
MD3:SENSE1
  Top 0.305: MD3:R1.3 63.35,28.75 62.6,29.5 MD3:IC1.10
MD3:SENSE2
  Top 0.305: MD3:IC1.9 MD3:IC1.8 60.7,28.5 MD3:R1.4
MD4:3V3_FILTERED
  Top 0.305: MD4:C8.2 57.65,14 MD4:IC1.6 54.49,14 54,14.49 54,16 52.75,17.25 43.17,17.25 MD4:JP3.2
  Top 0.508: MD4:C8.2 MD4:C7.2 MD4:L1.N2
MD4:A0  (via drill 0.3)
  Top 0.305: MD4:IC1.2 50.84,15.5 v50.5,15.16
  Bottom 0.305: MD4:JP3.1 MD4:JP3.3 MD4:JP3.5 MD4:JP3.7 50.5,14.42 v50.5,15.16
MD4:PWR_IN
  pour Top (isolate 0.406, no thermals): 66,14.5 66,17 59,17 59,20.5 71.5,20.5 71.5,15 71,14.5
MD4:PWR_OUT
  pour Top (isolate 0.406, no thermals): 77.5,15 72.5,15 71,13.5 66,13.5 66,10.5 77.5,10.5
MD4:SENSE1
  Top 0.305: MD4:R1.3 63.7,15 62.7,16 MD4:IC1.10
MD4:SENSE2
  Top 0.305: MD4:IC1.9 MD4:IC1.8 60.7,15 MD4:R1.4
N$1
  Top 1.016: U1.P$1 15.4,61.94 C3.1 15.08,57.68 D1.C
N$2
  Top 1.016: JP1.3 4.92,50.62 D1.A
N$3
  Top 0.508: LED1.C R1.2
N$4
  Bottom 1.016: JP2.1 JP1.1
N$5
  Top 1.016: D2.A 19.05,14.43 | Q1.2 19.09,14.47 19.05,14.43 | R4.2 19.05,14.43
N$6
  Top 1.016: JP2.3 20,54.4 C5.1 C4.1 20.6,61.94 U1.P$3
N$7
  Top 0.508: R6.2 LED2.C
N$8
  Top 1.016: Q1.3 21,24.92 R5.1
N$9
  Top 1.016: F1.1 16,45 19,48 JP2.2 C6.1
N$10
  Top 0.305: MD2:JP3.2 41.27,42.27 43.25,44.25 51,44.25 MD2:IC1.1 53.5,43 53.5,42 54.5,41 MD2:IC1.6 58.15,41 MD2:C8.2
  Top 0.508: MD2:C8.2 MD2:C7.2 MD2:L1.N2
PB8
  Top 0.508: CN10.3 32.73,63.28 JP3.5
PB9
  Top 0.508: CN10.5 37.81,62.64 JP3.1
PB10
  Bottom 0.508: JP3.7 33.42,62.5 51.5,62.5 52.83,63.83 52.83,64.71 53.52,65.4 62.79,65.4 CN10.28
PB11  (via drill 0.35)
  Top 0.305: JP3.3 35,59.54
  Top 0.508: 35,59.54 35,68 35.33,68.33 78.27,68.33 v78.61,68
  Bottom 0.508: v78.61,68 78.61,8.61 77.5,7.5 76.05,7.5 CN7.36
SCL
  Top 0.305: MD1:IC1.5 47.54,54.5 MD1:JP3.6 | MD2:JP3.6 47.54,41 MD2:IC1.5 | MD4:JP3.6 47.5,16.5 51.75,16.5 MD4:IC1.1 53.06,16 53.28,15.78 53.28,14.22 53.1,14.04 52.29,14.04 MD4:IC1.5 | MD3:JP3.6 47.54,27.5 MD3:IC1.5
  Top 0.508: JP3.6 31,56.73 | 31,56.73 JP3.8 | R2.1 30.85,56.58 31,56.73
  Bottom 0.305: MD2:JP3.6 45,41 32.73,41 | MD1:JP3.6 45,54.5 32.73,54.5 | MD3:JP3.6 45,27.5 32.73,27.5
  Bottom 0.508: JP3.6 32.73,54.5 32.73,41 32.73,27.5 32.73,24.77 40.5,17 44.54,17 MD4:JP3.6
SDA
  Top 0.305: MD1:IC1.4 51,55 50.5,55.5 50.5,56.5 50,57 44.96,57 | 44.96,57 MD1:JP3.4 | JP3.2 38.08,57 44.96,57 | MD2:IC1.4 50.5,41.5 50,42 50,43 49.5,43.5 44.96,43.5 MD2:JP3.4 42.46,41 37.81,41 | 37.81,27.5 42.46,27.5 MD3:JP3.4 44.96,30 51.75,30 MD3:IC1.1 53.06,29.5 53.28,29.28 53.28,28.22 53.1,28.05 52.3,28.05 MD3:IC1.4 | MD4:IC1.4 51,14.5 50.5,14 43,14
  Top 0.508: JP3.4 35.5,56.73 | 35.5,56.73 JP3.2 37.81,41 37.81,27.5 37.81,15.69 39.5,14 43,14 43.73,14.73 MD4:JP3.4 | R3.1 35.5,56.73
V+
  pour Power (isolate 0.813): -5,73 -5,-3 -5,-4 86,-4 86,15 86,75 85,75 -5,75
  pour Bottom (isolate 0.61): 12,25 4,25 4,39 12,39

### Text on the board
tNames: HE | IC1 | AP | Lab | GND | C8 | C6 | R1 | V+ | v1.0 | L1 | C7 | IF > 5V | IF = 5V | IC1 | Politecnico | GND | di Milano | C8 | V+ | R1 | V+ | L1 | C7 | V+ | IC1 | GND | V+ | C8 | V+ | R1 | L1 | C7 | GND | SmokyProbe | IC1 | GND | GND | C8 | V+ | 5V | R1 | GND | 3V3 | L1 | C7 | v1.0 / 2019
bNames: Designed by F.Reghenzani | V+ | V+ | V+ | GND | GND | GND | Zaneeeeeeeeella
tDocu: 5V | 3V3